# EAGLE design PCB Schematic (EAGLE 9.0.0)
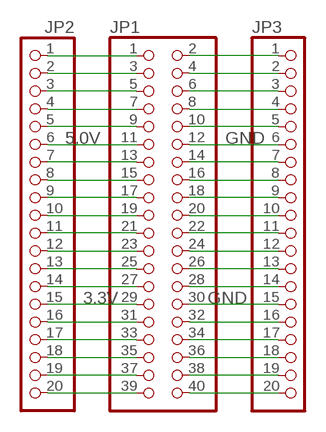
[diagram p0: schematic, sheet 1]

## Parts
JP1  PINHD-2X20  [2X20]
JP2  PINHD-1X20  [1X20]
JP3  PINHD-1X20  [1X20]

## Nets
3.3V: JP1.29 JP2.15
5.0V: JP1.11 JP2.6
GND: JP1.12 JP1.30 JP3.6 JP3.15
N$1: JP1.1 JP2.1
N$2: JP1.3 JP2.2
N$3: JP1.5 JP2.3
N$4: JP1.7 JP2.4
N$5: JP1.9 JP2.5
N$7: JP1.13 JP2.7
N$8: JP1.15 JP2.8
N$9: JP1.17 JP2.9
N$10: JP1.19 JP2.10
N$11: JP1.21 JP2.11
N$12: JP1.23 JP2.12
N$13: JP1.25 JP2.13
N$14: JP1.27 JP2.14
N$16: JP1.31 JP2.16
N$17: JP1.33 JP2.17
N$18: JP1.35 JP2.18
N$19: JP1.37 JP2.19
N$20: JP1.39 JP2.20
N$21: JP1.40 JP3.20
N$22: JP1.38 JP3.19
N$23: JP1.36 JP3.18
N$24: JP1.34 JP3.17
N$25: JP1.32 JP3.16
N$27: JP1.28 JP3.14
N$28: JP1.26 JP3.13
N$29: JP1.24 JP3.12
N$30: JP1.22 JP3.11
N$31: JP1.20 JP3.10
N$32: JP1.18 JP3.9
N$33: JP1.16 JP3.8
N$34: JP1.14 JP3.7
N$36: JP1.10 JP3.5
N$37: JP1.8 JP3.4
N$38: JP1.6 JP3.3
N$39: JP1.4 JP3.2
N$40: JP1.2 JP3.1

## Library data of the parts
JP1 = Pin_header_11:PINHD-2X20: PIN HEADER
JP2 JP3 = Pin_header_1x20:PINHD-1X20: PIN HEADER

## Board
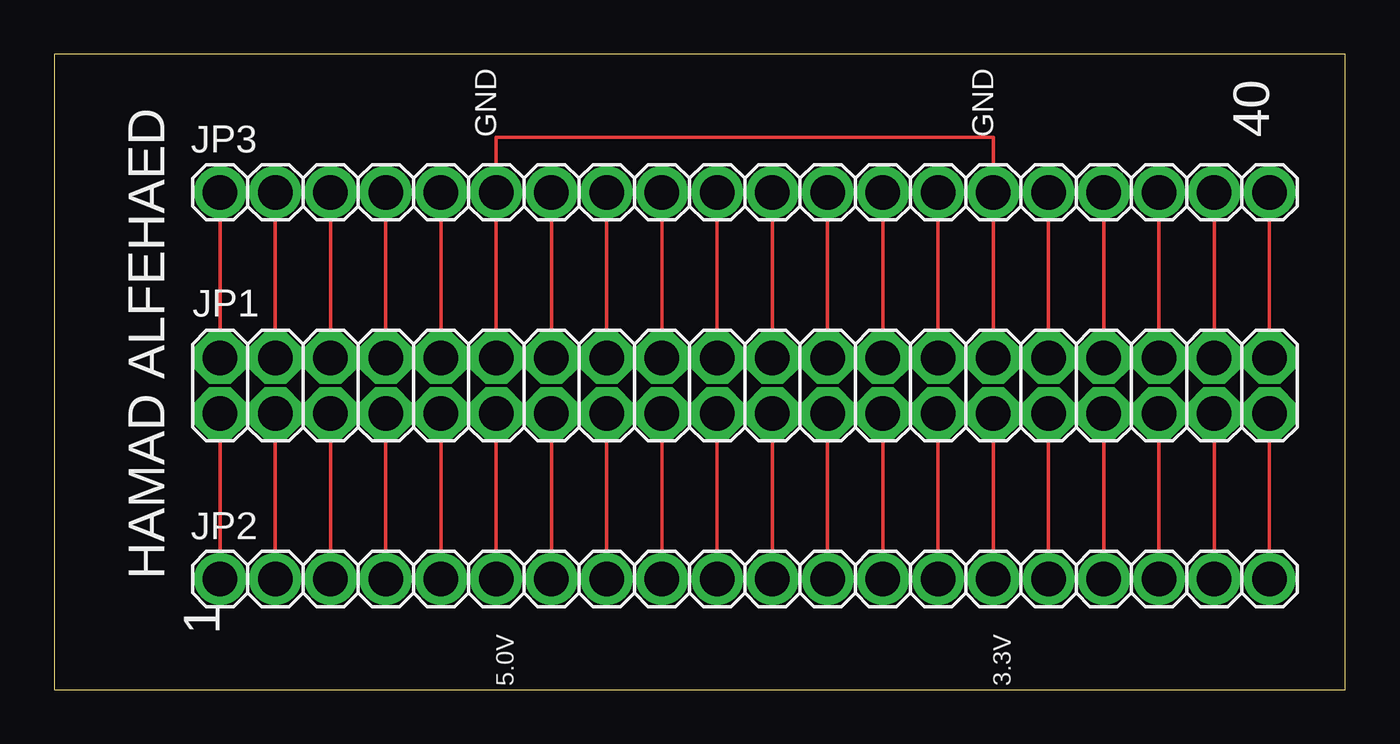
[diagram p1: board, top side]

Size 59.36 x 29.2 mm. Coordinates in mm from the lower left corner, seen from the top.
Outline: 0,0 59.36,0 59.36,29.2 0,29.2 0,0
Copper layers (1*16): Top 0.035mm / dielectric 1.5mm / Bottom 0.035mm
Design rules "default": minimum track width 6mil, minimum drill 0.35mm, track to track 6mil, track to pad 6mil, pad to pad 6mil, via to via 6mil, smd to smd 6mil, copper to edge 40mil, drill to drill 6mil, minimum pad ring 10mil, minimum via ring 8mil, stop-mask expansion 4mil, vias tented up to drill 0mil, thermal gap 10mil

### Footprints (pad centres in the part's own frame; a part is rotated, then mirrored left to right if it is on the bottom)
2X20 = drill 1.587 octagon: 1 -24.13,-1.27; 2 -24.13,1.27; 3 -21.59,-1.27; 4 -21.59,1.27; 5 -19.05,-1.27; 6 -19.05,1.27; 7 -16.51,-1.27; 8 -16.51,1.27; 9 -13.97,-1.27; 10 -13.97,1.27; 11 -11.43,-1.27; 12 -11.43,1.27; 13 -8.89,-1.27; 14 -8.89,1.27; 15 -6.35,-1.27; 16 -6.35,1.27; 17 -3.81,-1.27; 18 -3.81,1.27; 19 -1.27,-1.27; 20 -1.27,1.27; 21 1.27,-1.27; 22 1.27,1.27; 23 3.81,-1.27; 24 3.81,1.27; 25 6.35,-1.27; 26 6.35,1.27; 27 8.89,-1.27; 28 8.89,1.27; 29 11.43,-1.27; 30 11.43,1.27; 31 13.97,-1.27; 32 13.97,1.27; 33 16.51,-1.27; 34 16.51,1.27; 35 19.05,-1.27; 36 19.05,1.27; 37 21.59,-1.27; 38 21.59,1.27; 39 24.13,-1.27; 40 24.13,1.27
1X20 = drill 1.587: 1 -24.13,0; 2 -21.59,0; 3 -19.05,0; 4 -16.51,0; 5 -13.97,0; 6 -11.43,0; 7 -8.89,0; 8 -6.35,0; 9 -3.81,0; 10 -1.27,0; 11 1.27,0; 12 3.81,0; 13 6.35,0; 14 8.89,0; 15 11.43,0; 16 13.97,0; 17 16.51,0; 18 19.05,0; 19 21.59,0; 20 24.13,0

### Placement (x,y rotation side)
JP1  31.75,13.97 0 top
JP2  31.75,5.08 0 top
JP3  31.75,22.86 0 top

### Tracks (layer width: path | path; a pad name or v marks a point on that pad's centre or on a via)
3.3V
  Top 0.152: JP2.15 JP1.29
5.0V
  Top 0.152: JP1.11 JP2.6
GND
  Top 0.152: JP1.12 JP3.6 20.32,25.4 43.18,25.4 JP3.15 JP1.30
N$1
  Top 0.152: JP2.1 JP1.1
N$2
  Top 0.152: JP1.3 JP2.2
N$3
  Top 0.152: JP2.3 JP1.5
N$4
  Top 0.152: JP1.7 JP2.4
N$5
  Top 0.152: JP2.5 JP1.9
N$7
  Top 0.152: JP2.7 JP1.13
N$8
  Top 0.152: JP1.15 JP2.8
N$9
  Top 0.152: JP2.9 JP1.17
N$10
  Top 0.152: JP1.19 JP2.10
N$11
  Top 0.152: JP2.11 JP1.21
N$12
  Top 0.152: JP1.23 JP2.12
N$13
  Top 0.152: JP2.13 JP1.25
N$14
  Top 0.152: JP1.27 JP2.14
N$16
  Top 0.152: JP1.31 JP2.16
N$17
  Top 0.152: JP2.17 JP1.33
N$18
  Top 0.152: JP1.35 JP2.18
N$19
  Top 0.152: JP2.19 JP1.37
N$20
  Top 0.152: JP1.39 JP2.20
N$21
  Top 0.152: JP3.20 JP1.40
N$22
  Top 0.152: JP1.38 JP3.19
N$23
  Top 0.152: JP3.18 JP1.36
N$24
  Top 0.152: JP1.34 JP3.17
N$25
  Top 0.152: JP3.16 JP1.32
N$27
  Top 0.152: JP1.28 JP3.14
N$28
  Top 0.152: JP3.13 JP1.26
N$29
  Top 0.152: JP1.24 JP3.12
N$30
  Top 0.152: JP3.11 JP1.22
N$31
  Top 0.152: JP1.20 JP3.10
N$32
  Top 0.152: JP3.9 JP1.18
N$33
  Top 0.152: JP1.16 JP3.8
N$34
  Top 0.152: JP1.14 JP3.7
N$36
  Top 0.152: JP3.5 JP1.10
N$37
  Top 0.152: JP1.8 JP3.4
N$38
  Top 0.152: JP3.3 JP1.6
N$39
  Top 0.152: JP1.4 JP3.2
N$40
  Top 0.152: JP3.1 JP1.2

### Text on the board
tPlace: GND | GND | 40 | HAMAD ALFEHAED | 1 | 5.0V | 3.3V